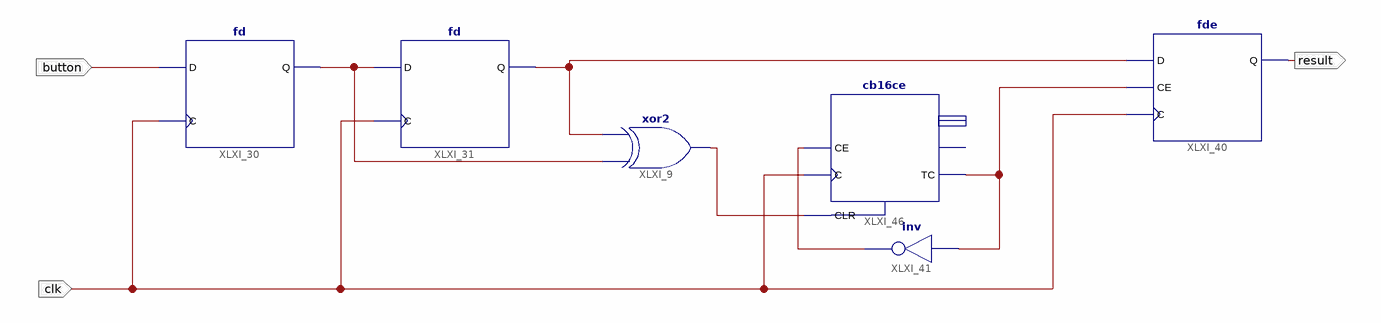
[diagram p0: schematic sheet 1]
// Xilinx ISE schematic db_fsm.sch (spartan3e) as structural Verilog: 6 symbols, 3 ports
module db_fsm (
  input  button,
  input  clk,
  output result
);

  wire XLXN_6, XLXN_7, XLXN_19, XLXN_23, XLXN_62;

  xor XLXI_9 (XLXN_7, XLXN_6, XLXN_19);
  fd XLXI_30 (.C(clk), .D(button), .Q(XLXN_6));
  fd XLXI_31 (.C(clk), .D(XLXN_6), .Q(XLXN_19));
  fde XLXI_40 (.C(clk), .CE(XLXN_62), .D(XLXN_19), .Q(result));
  not XLXI_41 (XLXN_23, XLXN_62);
  cb16ce XLXI_46 (.C(clk), .CE(XLXN_23), .CLR(XLXN_7), .TC(XLXN_62));  // open: CEO, Q
endmodule
